# Altium schematic sheet Sheet1.SchDoc
size 420 x 297 mm; Address1: Address1; Address2: Address2; Address3: Address3; Address4: Address4; DocumentNumber: АБВГ.123456.001 Э3; SheetNumber: 1; Scale: 1:1; DocumentType: Схема электрическая принципиальная; FirstReferrence: АБВГ.123456.001
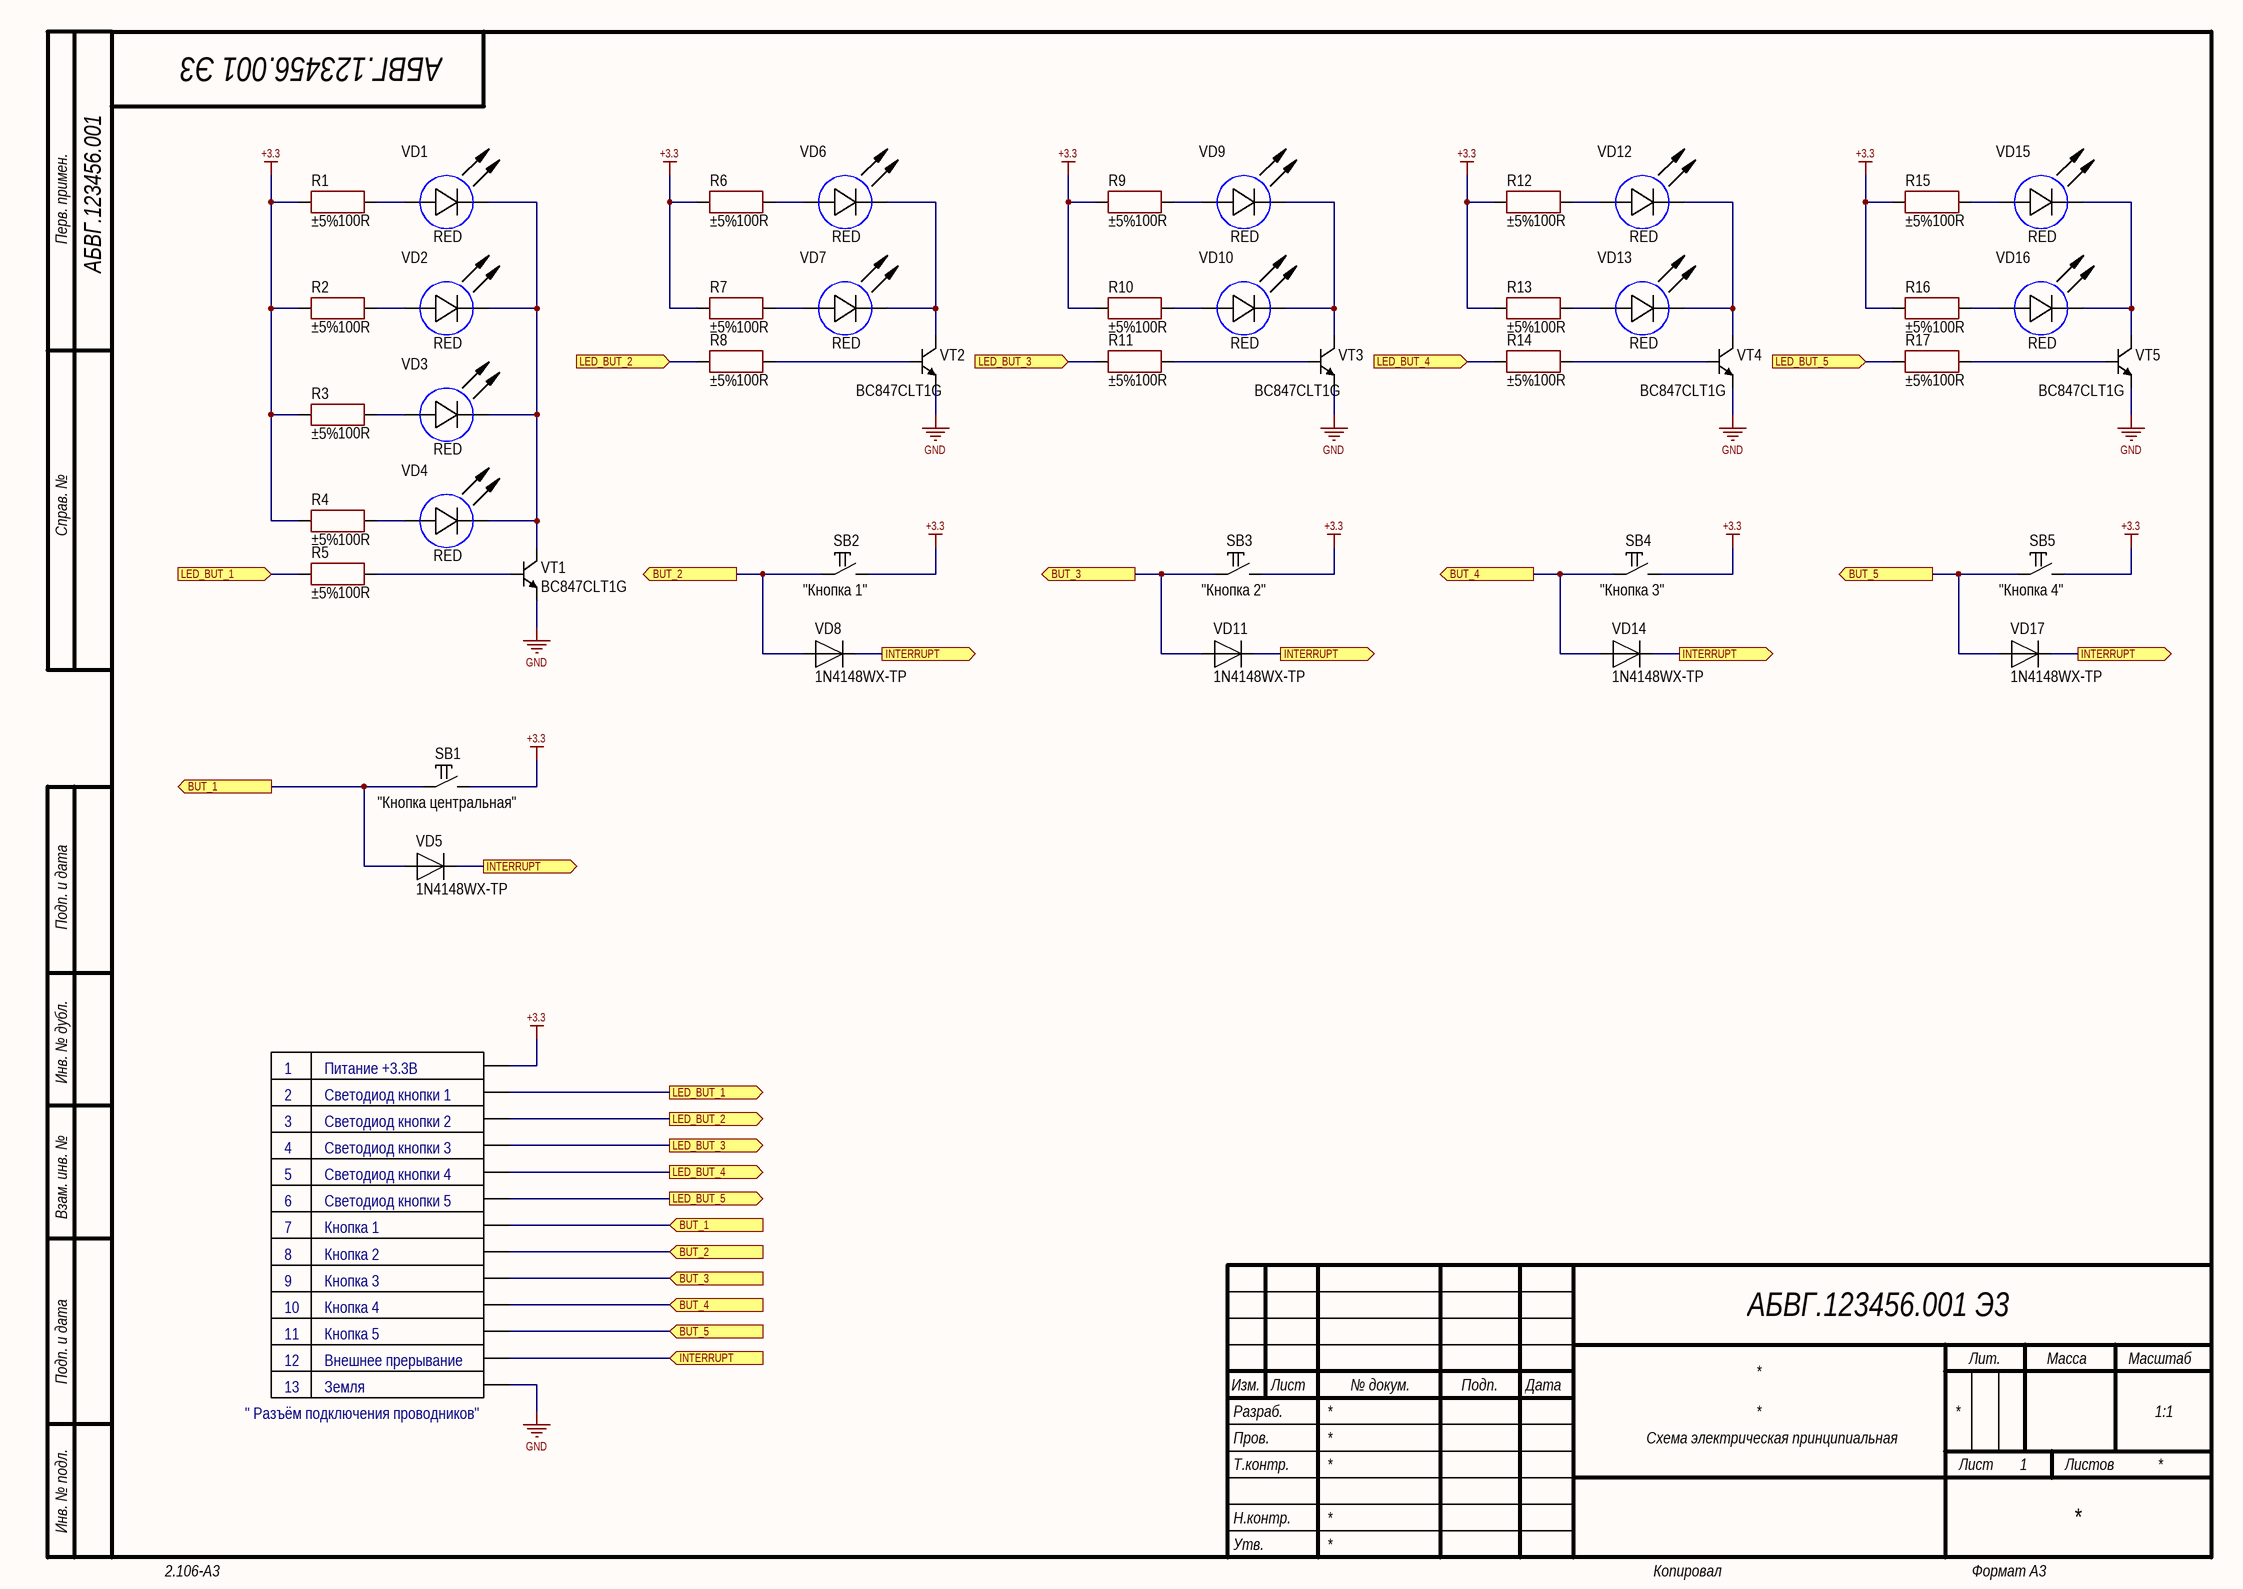
[diagram p0: Sheet1.SchDoc]

## Parts
R1  value 100R  Tolerance: ±5%  [RES: 0603]
R2  value 100R  Tolerance: ±5%  [RES: 0603]
R3  value 100R  Tolerance: ±5%  [RES: 0603]
R4  value 100R  Tolerance: ±5%  [RES: 0603]
R5  value 100R  Tolerance: ±5%  [RES: 0603]
R6  value 100R  Tolerance: ±5%  [RES: 0603]
R7  value 100R  Tolerance: ±5%  [RES: 0603]
R8  value 100R  Tolerance: ±5%  [RES: 0603]
R9  value 100R  Tolerance: ±5%  [RES: 0603]
R10  value 100R  Tolerance: ±5%  [RES: 0603]
R11  value 100R  Tolerance: ±5%  [RES: 0603]
R12  value 100R  Tolerance: ±5%  [RES: 0603]
R13  value 100R  Tolerance: ±5%  [RES: 0603]
R14  value 100R  Tolerance: ±5%  [RES: 0603]
R15  value 100R  Tolerance: ±5%  [RES: 0603]
R16  value 100R  Tolerance: ±5%  [RES: 0603]
R17  value 100R  Tolerance: ±5%  [RES: 0603]
SB1  CommentText: "Кнопка центральная"  [BUT: 5X5 SMD]
SB2  CommentText: "Кнопка 1"  [BUT: 5X5 SMD]
SB3  CommentText: "Кнопка 2"  [BUT: 5X5 SMD]
SB4  CommentText: "Кнопка 3"  [BUT: 5X5 SMD]
SB5  CommentText: "Кнопка 4"  [BUT: 5X5 SMD]
VD1  Color: RED  [LED: 0805R]
VD2  Color: RED  [LED: 0805R]
VD3  Color: RED  [LED: 0805R]
VD4  Color: RED  [LED: 0805R]
VD5  PartNumber: 1N4148WX-TP  [DIODE: SOD80]
VD6  Color: RED  [LED: 0805R]
VD7  Color: RED  [LED: 0805R]
VD8  PartNumber: 1N4148WX-TP  [DIODE: SOD80]
VD9  Color: RED  [LED: 0805R]
VD10  Color: RED  [LED: 0805R]
VD11  PartNumber: 1N4148WX-TP  [DIODE: SOD80]
VD12  Color: RED  [LED: 0805R]
VD13  Color: RED  [LED: 0805R]
VD14  PartNumber: 1N4148WX-TP  [DIODE: SOD80]
VD15  Color: RED  [LED: 0805R]
VD16  Color: RED  [LED: 0805R]
VD17  PartNumber: 1N4148WX-TP  [DIODE: SOD80]
VT1  PartNumber: BC847CLT1G  [SOT23]
VT2  PartNumber: BC847CLT1G  [SOT23]
VT3  PartNumber: BC847CLT1G  [SOT23]
VT4  PartNumber: BC847CLT1G  [SOT23]
VT5  PartNumber: BC847CLT1G  [SOT23]

## Ports
BUT_1 (in), BUT_1 (out), BUT_2 (in), BUT_2 (out), BUT_3 (in), BUT_3 (out), BUT_4 (in), BUT_4 (out), BUT_5 (in), BUT_5 (out), INTERRUPT (in), INTERRUPT (out), LED_BUT_1 (in), LED_BUT_1 (out), LED_BUT_2 (in), LED_BUT_2 (out), LED_BUT_3 (in), LED_BUT_3 (out), LED_BUT_4 (in), LED_BUT_4 (out), LED_BUT_5 (in), LED_BUT_5 (out)

## Nets
+3.3: R1.1 R2.1 R3.1 R4.1 R6.1 R7.1 R9.1 R10.1 R12.1 R13.1 R15.1 R16.1 SB1.2 SB2.2 SB3.2 SB4.2 SB5.2
GND: VT1.2(E) VT2.2(E) VT3.2(E) VT4.2(E) VT5.2(E)
BUT_1: SB1.1 VD5.1 ; port BUT_1
BUT_2: SB2.1 VD8.1 ; port BUT_2
BUT_3: SB3.1 VD11.1 ; port BUT_3
BUT_4: SB4.1 VD14.1 ; port BUT_4
BUT_5: SB5.1 VD17.1 ; port BUT_5
INTERRUPT: VD5.2 VD8.2 VD11.2 VD14.2 VD17.2 ; port INTERRUPT
LED_BUT_1: R5.1 ; port LED_BUT_1
LED_BUT_2: R8.1 ; port LED_BUT_2
LED_BUT_3: R11.1 ; port LED_BUT_3
LED_BUT_4: R14.1 ; port LED_BUT_4
LED_BUT_5: R17.1 ; port LED_BUT_5
NetR1_2: R1.2 VD1.1(A)
NetR2_2: R2.2 VD2.1(A)
NetR3_2: R3.2 VD3.1(A)
NetR4_2: R4.2 VD4.1(A)
NetR5_2: R5.2 VT1.1(B)
NetR6_2: R6.2 VD6.1(A)
NetR7_2: R7.2 VD7.1(A)
NetR8_2: R8.2 VT2.1(B)
NetR9_2: R9.2 VD9.1(A)
NetR10_2: R10.2 VD10.1(A)
NetR11_2: R11.2 VT3.1(B)
NetR12_2: R12.2 VD12.1(A)
NetR13_2: R13.2 VD13.1(A)
NetR14_2: R14.2 VT4.1(B)
NetR15_2: R15.2 VD15.1(A)
NetR16_2: R16.2 VD16.1(A)
NetR17_2: R17.2 VT5.1(B)
NetVD1_2: VD1.2(C) VD2.2(C) VD3.2(C) VD4.2(C) VT1.3(C)
NetVD6_2: VD6.2(C) VD7.2(C) VT2.3(C)
NetVD9_2: VD9.2(C) VD10.2(C) VT3.3(C)
NetVD12_2: VD12.2(C) VD13.2(C) VT4.3(C)
NetVD15_2: VD15.2(C) VD16.2(C) VT5.3(C)

## Notes on the sheet
- 1
- 2
- 3
- Питание +3.3В
- Светодиод кнопки 1
- Светодиод кнопки 2
- 4
- 5
- 6
- Светодиод кнопки 3
- Светодиод кнопки 4
- Светодиод кнопки 5
- 7
- 8
- Кнопка 1
- Кнопка 2
- 9
- 10
- 11
- Кнопка 3
- Кнопка 4
- Кнопка 5
- 12
- 13
- Внешнее прерывание
- Земля
- " Разъём подключения проводников"
- Перв. примен.
- Справ. №
- Подп. и дата
- Инв. № дубл.
- Взам. инв. №
- Разраб.
- Изм.
- Лист
- № докум.
- Подп.
- Дата
- Лит.
- Масса
- Масштаб
- Пров.
- Т.контр.
- Листов
- Инв. № подл.
- Утв.
- Н.контр.
- 2.106-A3
- Копировал
- Формат А3

## Library data of the parts
R1-R17 = Resistor_0603: Manufacturer: Yageo; PartNumber: RC0603JR-07100RL; ValueManufacturerPartNumber: Resistor film, 100R, ±5%, 0603, 0.1W, -55...+125°C; TypeResistor: Resistor film; Power: 0.1W; Package: 0603; HelpURL: https://www.digikey.com/product-detail/en/yageo/RC0603JR-07100RL/311-100GRCT-ND/729644; Temperature: -55...+125°C
SB1-SB5 = Button_tactile: Manufacturer: TE Connectivity; ValueManufacturerPartNumber: Tactile button, 6x6mm; PartNumber: FSM2JSMAATR; TypeButton: Tactile button; HelpURL: https://www.digikey.com/product-detail/en/te-connectivity-alcoswitch-switches/FSM2JSMAATR/450-1792-1-ND/3503931; Package: 6x6mm
VD1-VD4 VD6 VD7 VD9 VD10 VD12 VD13 VD15 VD16 = LED_single: ValueManufacturerPartNumber: LED, Green, *, *, *, -55...+150°C; TypeDiode: LED; ColorParameter: Green; Manufacturer: *; Package: *; HelpURL: *; Temperature: -55...+150°C; Current: *; VoltageDrop: *; PartNumber: *
VD5 VD8 VD11 VD14 VD17 = Diode_single: Manufacturer: Micro Commercial; ValueManufacturerPartNumber: Single diode, 75V, 150mA, 1V, 4ns, SOD-323, -55...+150°C; TypeDiode: Single diode; Voltage: 75V; Current: 150mA; VoltageDrop: 1V; RecoveryTime: 4ns; Package: SOD-323; HelpURL: https://www.digikey.com/product-detail/en/micro-commercial-co/1N4148WX-TP/1N4148WXTPMSCT-ND/717312; Temperature: -55...+150°C
VT1-VT5 = BJT_NPN_132: Manufacturer: ON Semiconductor; ValueManufacturerPartNumber: NPN transistor, 45V, 100mA, 100MHz, 300mW, 0.6V, 420, SOT-23, -55...+125°C; TypeTransistor: NPN transistor; VoltageCE: 45V; CurrentCE: 100mA; VoltageSaturation: 0.6V; Frequency: 100MHz; CurrentGain: 420; MaxPower: 300mW; Package: SOT-23; HelpURL: https://www.digikey.com/product-detail/en/on-semiconductor/BC847CLT1G/BC847CLT1GOSCT-ND/917836; Temperature: -55...+125°C